# Altium project SignalSelector.PrjPcb
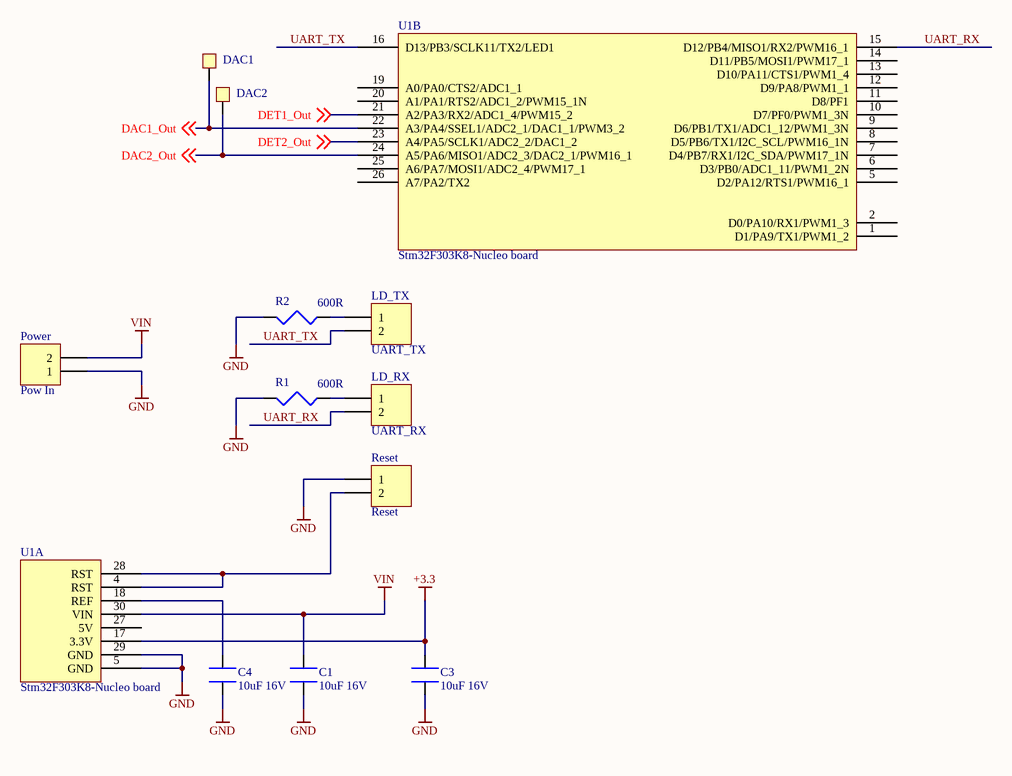
[diagram p0: Control.SchDoc]
2 sheets, 30 parts. Net scope: global (net labels, ports and power ports of the same name join across sheets).
Board file: PCB1.PcbDoc
Sheets:
  Control.SchDoc
  Input.SchDoc

## Sheet Control.SchDoc
size A4

### Parts
C1  10uF 16V  [0805_C]
C3  10uF 16V  [0805_C]
C4  10uF 16V  [0805_C]
DAC1  Point  [Test_Point]  (value not drawn)
DAC2  Point  [Test_Point]  (value not drawn)
LD_RX  UART_RX  [HDR1X2]
LD_TX  UART_TX  [HDR1X2]
Power  Pow In  [HDR1X2]
R1  600R  [0805_R]
R2  600R  [0805_R]
Reset  Reset  [HDR1X2]
U1  Stm32F303K8-Nucleo board  [F303-Nucleo]  (parts A,B of 2)

### Nets
+3.3: C3.1 U1.17(3.3V)
GND: C1.2 C3.2 C4.2 Power.1 R1.1 R2.1 Reset.1 U1.5(GND) U1.29(GND)
VIN: C1.1 Power.2 U1.30(VIN)
DAC1_Out: DAC1.1 U1.22(A3/PA4/SSEL1/ADC2_1/DAC1_1/PWM3_2) ; off-sheet DAC1_Out
DAC2_Out: DAC2.1 U1.24(A5/PA6/MISO1/ADC2_3/DAC2_1/PWM16_1) ; off-sheet DAC2_Out
DET1_Out: U1.21(A2/PA3/RX2/ADC1_4/PWM15_2) ; off-sheet DET1_Out
DET2_Out: U1.23(A4/PA5/SCLK1/ADC2_2/DAC1_2) ; off-sheet DET2_Out
UART_RX: LD_RX.2 U1.15(D12/PB4/MISO1/RX2/PWM16_1)
UART_TX: LD_TX.2 U1.16(D13/PB3/SCLK11/TX2/LED1)
NetC4_1: C4.1 U1.18(REF)
NetLD_RX_1: LD_RX.1 R1.2
NetLD_TX_1: LD_TX.1 R2.2
NetReset_2: Reset.2 U1.4(RST) U1.28(RST)

Not connected (* = marked no-connect by the designer): U1 1(D1/PA9/TX1/PWM1_2) 2(D0/PA10/RX1/PWM1_3) 6(D3/PB0/ADC1_11/PWM1_2N) 7(D4/PB7/RX1/I2C_SDA/PWM17_1N) 8(D5/PB6/TX1/I2C_SCL/PWM16_1N) 9(D6/PB1/TX1/ADC1_12/PWM1_3N) 10(D7/PF0/PWM1_3N) 11(D8/PF1) 12(D9/PA8/PWM1_1) 13(D10/PA11/CTS1/PWM1_4) 14(D11/PB5/MOSI1/PWM17_1) 19(A0/PA0/CTS2/ADC1_1) 20(A1/PA1/RTS2/ADC1_2/PWM15_1N) 25(A6/PA7/MOSI1/ADC2_4/PWM17_1) 26(A7/PA2/TX2) 27(5V)

### Library data of the parts
C1 C3 C4 = Cap
LD_RX LD_TX Power Reset = Header 2: Header, 2-Pin; LatestRevisionDate: 17-Jul-2002; LatestRevisionNote: Re-released for DXP Platform.; Publisher: Altium Limited
R1 R2 = Res
U1 = F303-Nucleo

## Sheet Input.SchDoc
size A4
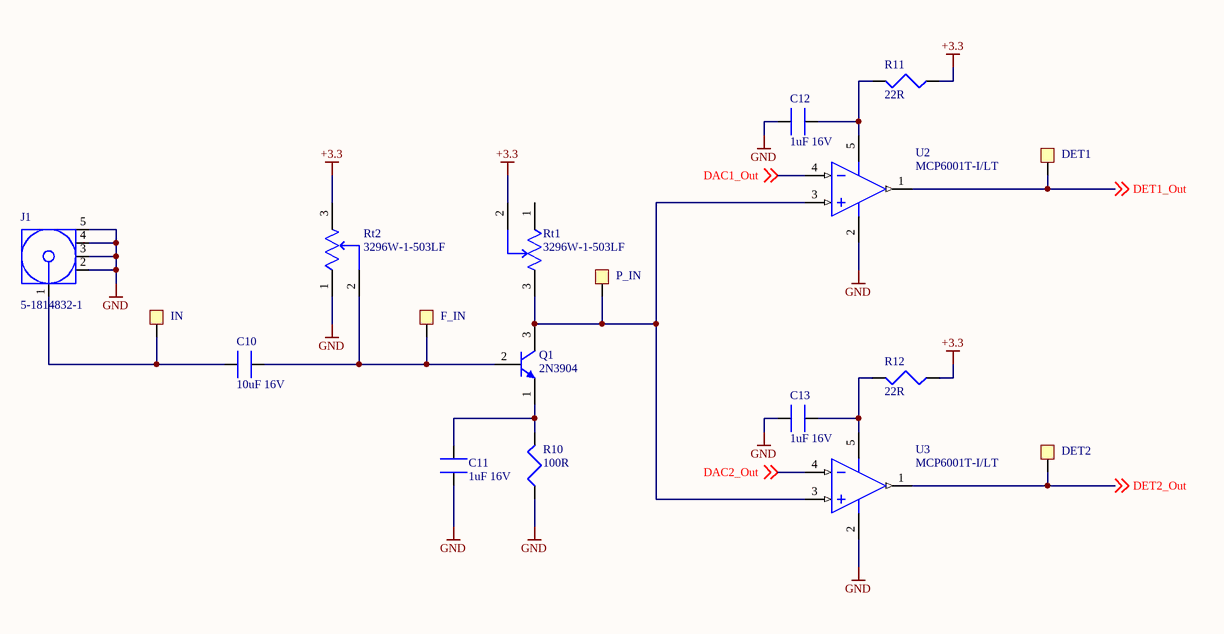
[diagram p1: Input.SchDoc]

### Parts
C10  10uF 16V  [0805_C]
C11  1uF 16V  [0805_C]
C12  1uF 16V  [0805_C]
C13  1uF 16V  [0805_C]
DET1  Point  [Test_Point]  (value not drawn)
DET2  Point  [Test_Point]  (value not drawn)
F_IN  Point  [Test_Point]  (value not drawn)
IN  Point  [Test_Point]  (value not drawn)
J1  5-1814832-1  [TECO-5-1814832-1_V]
P_IN  Point  [Test_Point]  (value not drawn)
Q1  2N3904  [ONSC-TO-92-3-29-11]
R10  100R  [0805_R]
R11  22R  [0805_R]
R12  22R  [0805_R]
Rt1  3296W-1-503LF  [FP-3296W-MFG]
Rt2  3296W-1-503LF  [FP-3296W-MFG]
U2  MCP6001T-I/LT  [SC70-LT5_M]
U3  MCP6001T-I/LT  [SC70-LT5_M]

### Nets
+3.3: R11.2 R12.2 Rt1.2(WIPER) Rt2.3(CW)
GND: C11.1 C12.2 C13.2 J1.2 J1.3 J1.4 J1.5 R10.2 Rt2.1(CCW) U2.2(VSS) U3.2(VSS)
DAC1_Out: U2.4(VIN-) ; off-sheet DAC1_Out
DAC2_Out: U3.4(VIN-) ; off-sheet DAC2_Out
DET1_Out: DET1.1 U2.1(VOUT) ; off-sheet DET1_Out
DET2_Out: DET2.1 U3.1(VOUT) ; off-sheet DET2_Out
NetC10_1: C10.1 IN.1 J1.1
NetC10_2: C10.2 F_IN.1 Q1.2(B) Rt2.2(WIPER)
NetC11_2: C11.2 Q1.1(E) R10.1
NetC12_1: C12.1 R11.1 U2.5(VDD)
NetC13_1: C13.1 R12.1 U3.5(VDD)
NetP_IN_1: P_IN.1 Q1.3(C) Rt1.3(CW) U2.3(VIN+) U3.3(VIN+)

Not connected (* = marked no-connect by the designer): Rt1 1(CCW)

### Library data of the parts
C10-C13 = Cap
J1 = CMP-2000-05415-1: SMA Connector, Pitch 5.08 mm, 1 Position, Height 9.5 mm, Tail Length 4 mm, -65 to 165 degC, RoHS, Bulk; Manufacturer: TE Connectivity; Connector Mounting: PCBMount; Connector Body Style: StraightJack; Impedance: 50ohm; Coaxial Termination: Solder; SVHC: NoSVHC(15-Jun-2015); Frequency Max: 3GHz; Product Range: ZDCSeries; Connector Type: SMACoaxial; Datasheet Version: Rev. B1, 03/2011; Package Reference: 5-1814832-1; Package Description: SMA Connector, Pitch 5.08 mm, 1 Position, Height 9.5 mm, Tail Length 4 mm; Contact Plating: GoldPlatedContacts; Coaxial Cable Types: -; Contact Material: BerylliumCopper; Manufacturer URL: http://www.te.com/; Datasheet URL: http://www.onlinecomponents.com/productFiles/mf-AMP/eng_cd_1814832_a.pdf
Q1 = CMP-2000-05562-1: General Purpose Transistor, NPN Silicon, 200 mA, 60 V, -55 to 150 degC, 3-Pin TO-92, RoHS, Bulk; Manufacturer: ONSemiconductor; Emitter- Base Voltage VEBO: 6V; Maximum Power Dissipation: 625mW; Maximum DC Collector Current: 0.2A; Collector- Emitter Voltage VCEO Max: 40V; Collector- Base Voltage VCBO: 60V; DC Collector/Base Gain hfe Min: 60; Configuration: Single; Collector-Emitter Saturation Voltage: 0.3V; Gain Bandwidth Product fT: 270MHz; Mounting Style: ThroughHole; Package / Case: TO-92-3(TO-226); Mounting Technology: ThroughHole; Minimum Operating Temperature: -65C; Datasheet Version: Rev. 8, 08/2012; Product Category: BipolarTransistors-BJT; Factory Pack Quantity: 5000; Transistor Polarity: NPN; Package Description: 3-Pin Transistor Outline, Body 4.825 x 3.685 mm, Pitch 1.27 mm; RoHS: Details; Datasheet URL: https://datasheet.ciiva.com/4725/2n3903-d-285841-4725808.pdf; Packaging: Bulk; Maximum Operating Temperature: +150C; Package Reference: TO-92-3-29-11; Brand: ONSemiconductor; Manufacturer URL: http://www.onsemi.com/
R10-R12 = Res
Rt1 Rt2 = CMP-2000-05583-2: TRIMMER 50K OHM 0.5W PC PIN TOP; Manufacturer: Bourns; Manufacturer Part Number: 3296W-1-504LF; Resistance: 500kΩ; Temperature Coefficient: 100ppm/°C; Value: 500kΩ; Tolerance: 10%; Voltage Rating: 300V; Standoff Height: 0.38mm; ComponentLink2Description: Datasheet; Package: 3296W; Series: Trimpot 3296-Sealed; Lead Free: Yes; Octopart: https://octopart.com/3296w-1-504lf-bourns-143884; Device Class L2: Resistors; Automotive: No; RoHS: TRUE; Temperature Range High: +125°C; Height: 12.05mm; Power Rating: 0.5W; Temperature Range Low: -55°C; ComponentLink2URL: https://www.bourns.com/docs/Product-Datasheets/3296.pdf; Device Class L1: Passive Components; Device Class L3: Variable Resistors and Potentiometers; Category: Res; Temperature: -55°C to +125°C; Digikey Description: TRIMMER 500K OHM 0.5W PC PIN TOP; Mouser Description: Trimmer; Cermet; Rest 500 Kilohms; PCB; 25 Turns; Pwr-Rtg 0.5W
U2 U3 = CMP-0187-00457-2: 1 MHz, Low-Power Operational Amplifier, 5-Pin SC-70, Industrial Temperature, Tape and Reel; RevisionNote: URLs added.; ComponentLink2Description: Datasheet; ComponentLink3URL: http://www.microchip.com/stellent/groups/techpub_sg/documents/packagingspec/en012702.pdf; PackageReference: SC70-LT5; PackageDescription: 5-Lead Plastic Small Outline Transistor (LT) [SC70]; ComponentLink2URL: http://ww1.microchip.com/downloads/en/DeviceDoc/21733j.pdf; ComponentLink3Description: Package Specification; PackageVersion: revBB, Aug-2009; ComponentLink1Description: Manufacturer URL; DatasheetVersion: revJ, Nov-2009; ComponentLink1URL: http://www.microchip.com/; Code_IPC: SOT353-5

## Nets that join several sheets
+3.3: Control (C3.1 U1.17), Input (R11.2 R12.2 Rt1.2 Rt2.3)
GND: Control (9 pins), Input (11 pins)
DAC1_Out: Control (DAC1.1 U1.22), Input (U2.4)
DAC2_Out: Control (DAC2.1 U1.24), Input (U3.4)
DET1_Out: Control (U1.21), Input (DET1.1 U2.1)
DET2_Out: Control (U1.23), Input (DET2.1 U3.1)